# EasyEDA schematic schematics.json
TITLE: Sheet_1; REV: 1.0; Date: 2024-05-22; Sheet: 1/1; Drawn By: ishbhir; Company: Your Company
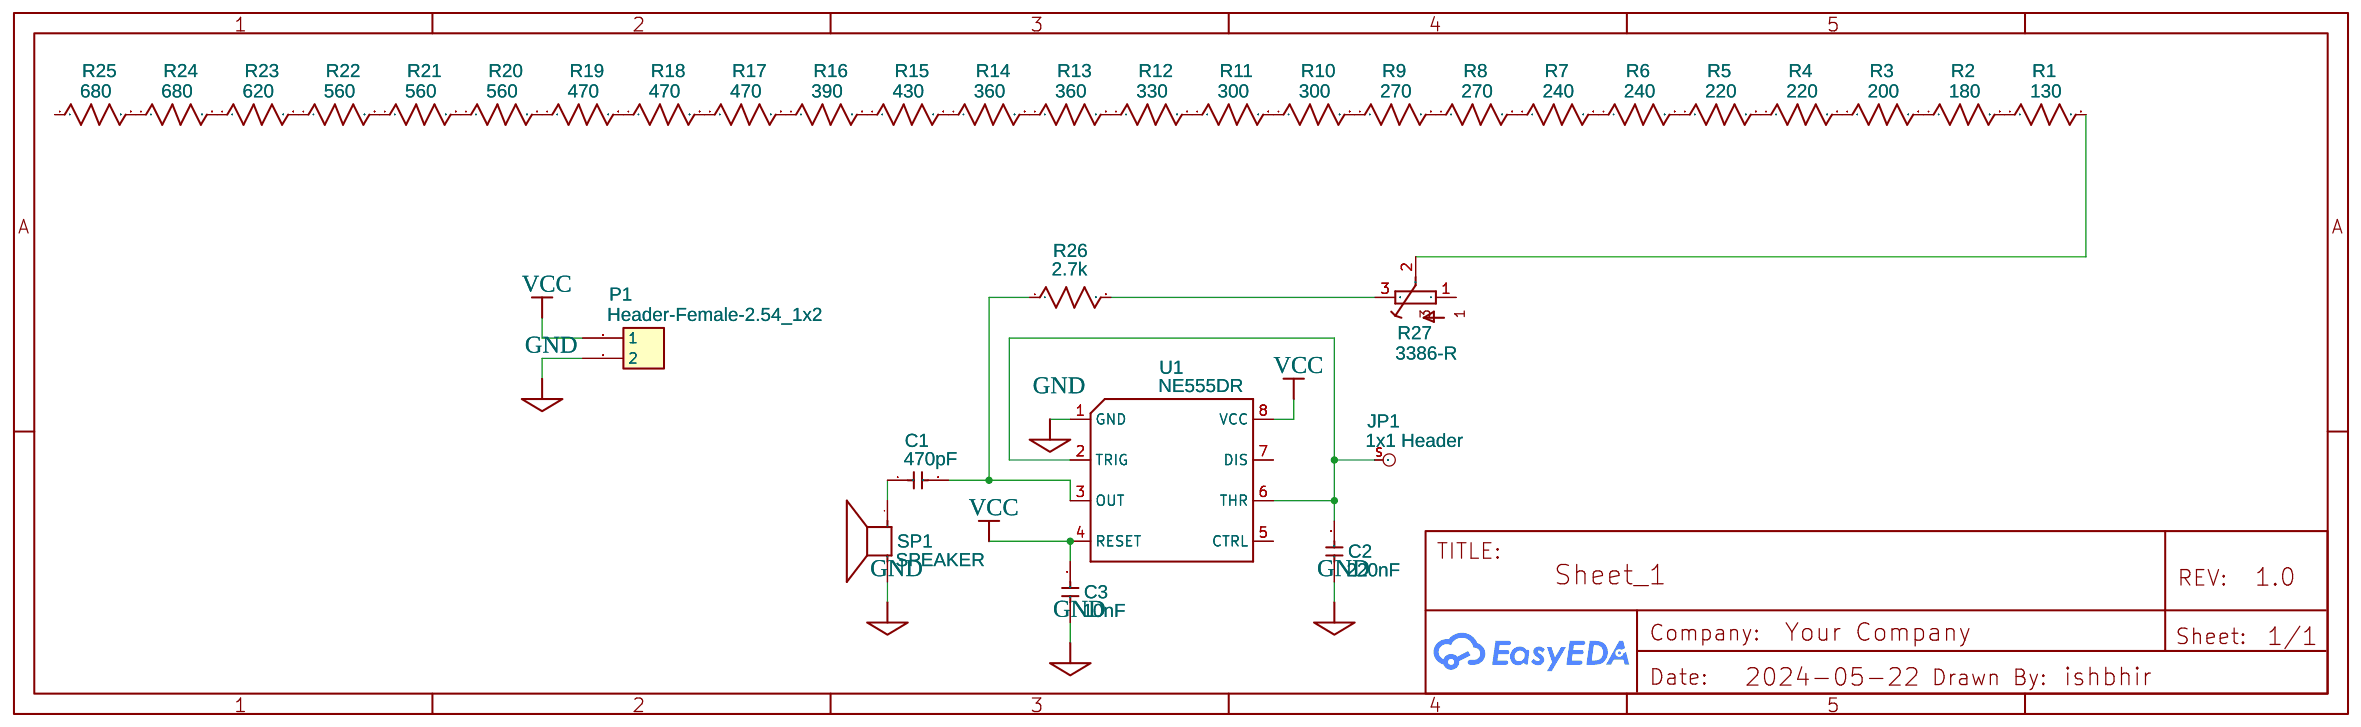
[diagram p0: schematic sheet]

## Parts
C1  470pF  [C0603]
C2  220nF  [C0603]
C3  10nF  [C0603]
JP1  1x1 Header  [1X1 HEADER]
P1  Header-Female-2.54_1x2  [HDR-1X2/2.54]
R1  130  [0603]
R2  180  [0603]
R3  200  [0603]
R4  220  [0603]
R5  220  [0603]
R6  240  [0603]
R7  240  [0603]
R8  270  [0603]
R9  270  [0603]
R10  300  [0603]
R11  300  [0603]
R12  330  [0603]
R13  360  [0603]
R14  360  [0603]
R15  430  [0603]
R16  390  [0603]
R17  470  [0603]
R18  470  [0603]
R19  470  [0603]
R20  560  [0603]
R21  560  [0603]
R22  560  [0603]
R23  620  [0603]
R24  680  [0603]
R25  680  [0603]
R26  2.7k  [0603]
R27  3386-R  [3386R]
SP1  SPEAKER  [AL11P]
U1  NE555DR  [SOIC8-1.27-5X4MM]

## Library data of the parts
C1 = -: SMD CAP Ceramic 470pF-100V-5%-NP0; catid: 20; Manufacturer Part: GRM1885C2A471JA01D
C2 = -: SMD CAP Ceramic 220nF-25V-10%-X7R;0603; catid: 20; Manufacturer Part: CC0603KRX7R8BB224
C3 = -: SMD CAP Ceramic 10nF-50V-10%-X7R; catid: 20; Manufacturer Part: CC0603KRX7R9BB103
JP1 = -: PIN HEADER; catid: 20; Contributor: Adafruit; sourceId: i5d7pHZhZ; Manufacturer Part: ?
P1 = -: LCSC: C49661; Supplier: LCSC; Manufacturer: LCSC
R1-R26 = Resistor: Manufacturer Part: ?
R27 = -: catid: 20; Manufacturer Part: ?
SP1 = -: catid: 20; Contributor: Adafruit; Manufacturer Part: ?
U1 = -: SMD IC Clock/Timing;; catid: 20; sourceId: bnhztL3kC

## Nets
GND: C2.1 C3.1 P1.2 SP1.+ U1.1(GND)
VCC: C3.2 P1.1 U1.4(RESET) U1.8(VCC)
Net-(C1-1): C1.1 SP1.-
Net-(C1-2): C1.2 R26.1 U1.3(OUT)
Net-(C2-2): C2.2 JP1.S U1.2(TRIG) U1.6(THR)
Net-(R1-1): R1.1 R2.2
Net-(R1-2): R1.2 R27.2
Net-(R2-1): R2.1 R3.2
Net-(R3-1): R3.1 R4.2
Net-(R4-1): R4.1 R5.2
Net-(R5-1): R5.1 R6.2
Net-(R6-1): R6.1 R7.2
Net-(R7-1): R7.1 R8.2
Net-(R8-1): R8.1 R9.2
Net-(R9-1): R9.1 R10.2
Net-(R10-1): R10.1 R11.2
Net-(R11-1): R11.1 R12.2
Net-(R12-1): R12.1 R13.2
Net-(R13-1): R13.1 R14.2
Net-(R14-1): R14.1 R15.2
Net-(R15-1): R15.1 R16.2
Net-(R16-1): R16.1 R17.2
Net-(R17-1): R17.1 R18.2
Net-(R18-1): R18.1 R19.2
Net-(R19-1): R19.1 R20.2
Net-(R20-1): R20.1 R21.2
Net-(R21-1): R21.1 R22.2
Net-(R22-1): R22.1 R23.2
Net-(R23-1): R23.1 R24.2
Net-(R24-1): R24.1 R25.2
Net-(R26-2): R26.2 R27.3

Not connected (* = marked no-connect by the designer): R25 1; R27 1; U1 5(CTRL) 7(DIS)
